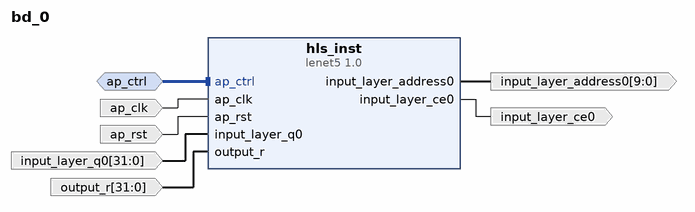
[diagram p0: block diagram of the top level]
# Vivado block design bd_0, xczu7ev-ffvc1156-2-e, Vivado 2024.2
create_bd_design bd_0

create_bd_intf_port -mode Slave -vlnv xilinx.com:interface:acc_handshake_rtl:1.0 ap_ctrl
create_bd_port -dir I -type clk ap_clk
set_property -dict {CONFIG.FREQ_HZ 100000000.0} [get_bd_ports ap_clk]
create_bd_port -dir I -type rst ap_rst
set_property -dict {CONFIG.POLARITY ACTIVE_HIGH} [get_bd_ports ap_rst]
create_bd_port -dir O -from 9 -to 0 -type data input_layer_address0
create_bd_port -dir O input_layer_ce0
create_bd_port -dir I -from 31 -to 0 -type data input_layer_q0
create_bd_port -dir I -from 31 -to 0 -type data output_r

create_bd_cell -type ip -vlnv xilinx.com:hls:lenet5:1.0 hls_inst

# ---- connections ----

connect_bd_intf_net -intf_net ap_ctrl_0_1 [get_bd_intf_ports ap_ctrl] [get_bd_intf_pins hls_inst/ap_ctrl]
connect_bd_net -net ap_clk_0_1 [get_bd_ports ap_clk] [get_bd_pins hls_inst/ap_clk]
connect_bd_net -net ap_rst_0_1 [get_bd_ports ap_rst] [get_bd_pins hls_inst/ap_rst]
connect_bd_net [get_bd_pins hls_inst/input_layer_address0] [get_bd_ports input_layer_address0]
connect_bd_net [get_bd_pins hls_inst/input_layer_ce0] [get_bd_ports input_layer_ce0]
connect_bd_net -net input_layer_q0_0_1 [get_bd_ports input_layer_q0] [get_bd_pins hls_inst/input_layer_q0]
connect_bd_net -net output_r_0_1 [get_bd_ports output_r] [get_bd_pins hls_inst/output_r]

validate_bd_design
save_bd_design
